# EAGLE design DINRELAY8 (EAGLE 8.7.0)
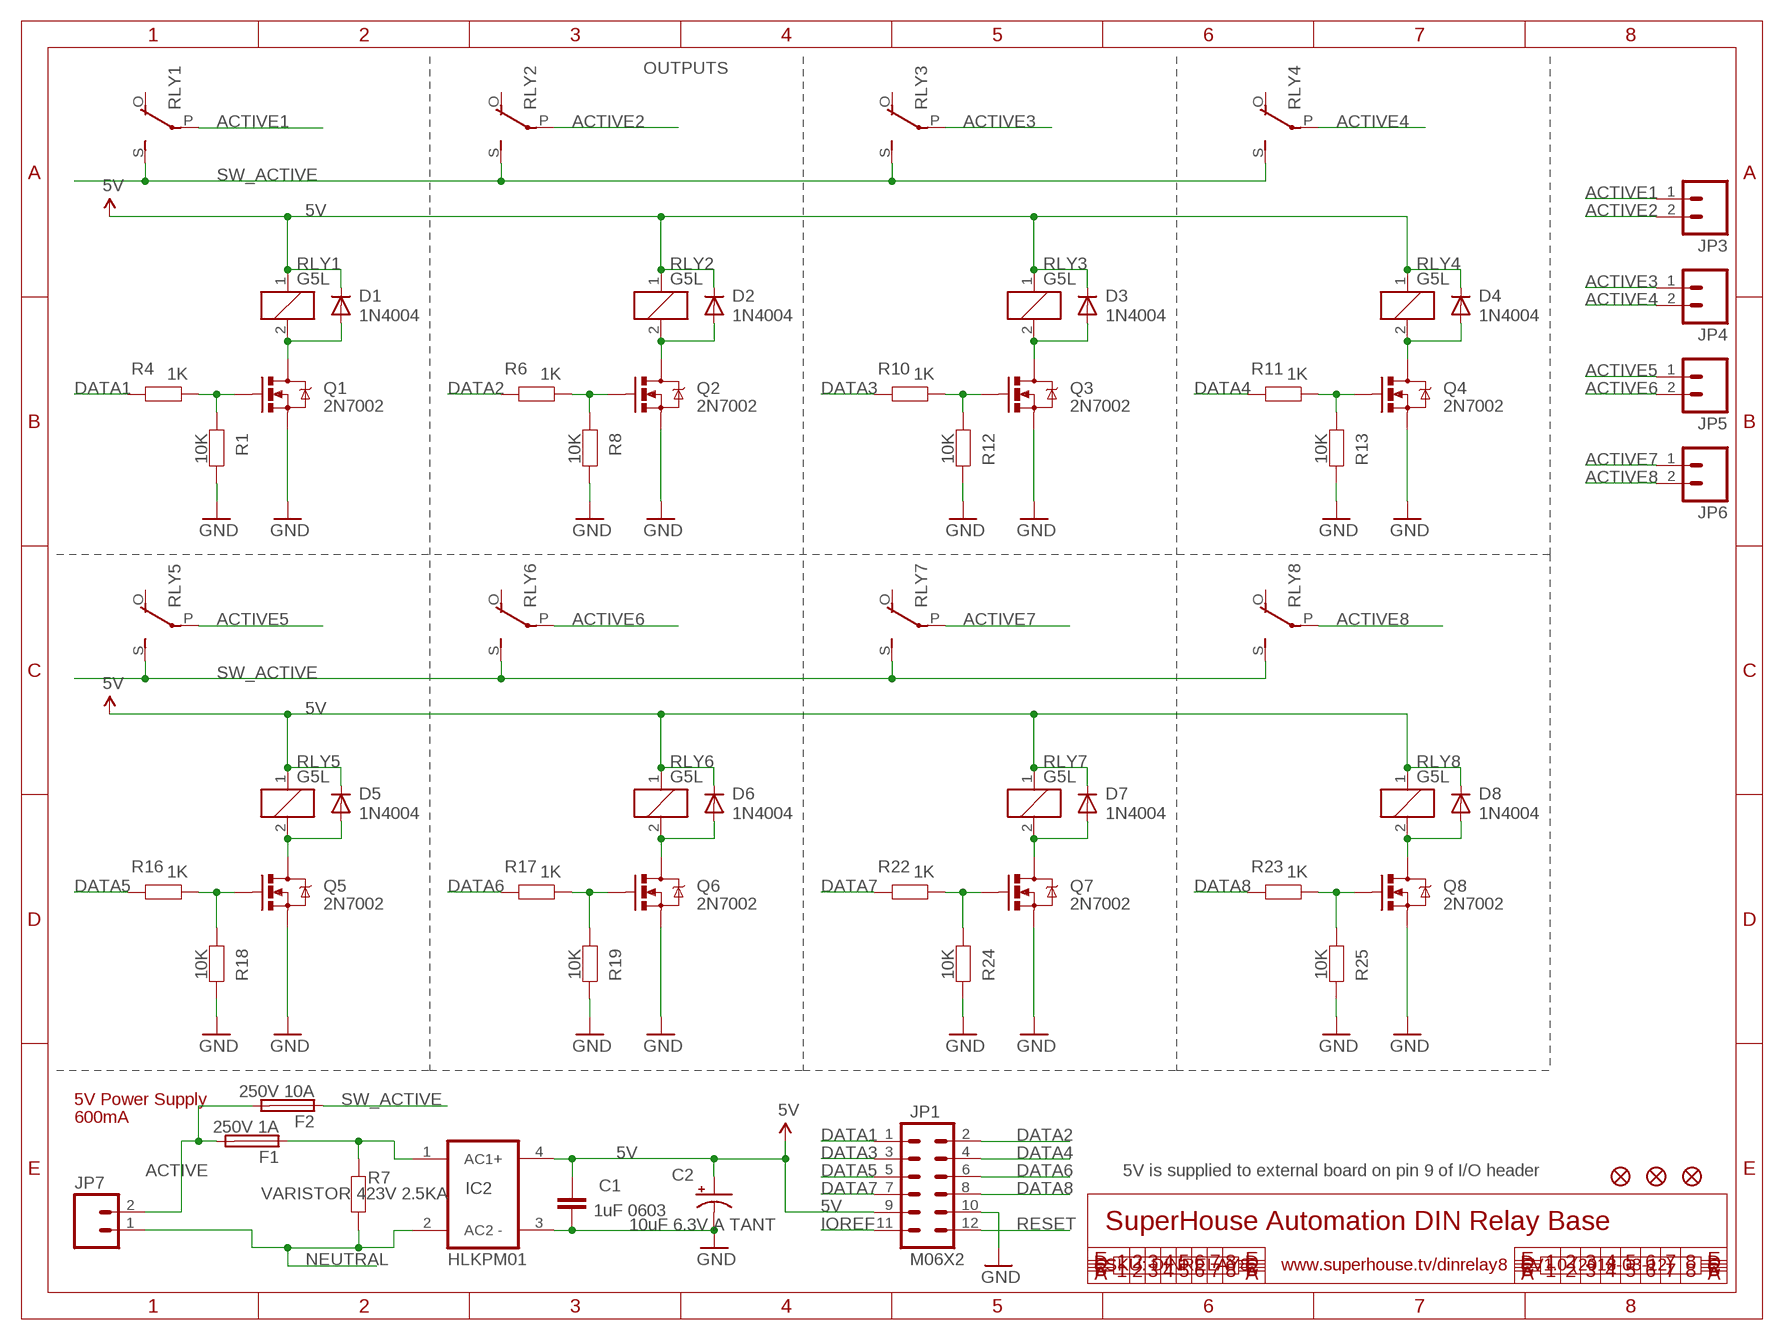
[diagram p0: schematic, sheet 1]

## Parts
C1  1uF 0603  CAP0603  [0603@1]
C2  10uF 6.3V A TANT  CAP_POL1206  [EIA3216]
D1  1N4004  DIODESMB  [SMB-DIODE]
D2  1N4004  DIODESMB  [SMB-DIODE]
D3  1N4004  DIODESMB  [SMB-DIODE]
D4  1N4004  DIODESMB  [SMB-DIODE]
D5  1N4004  DIODESMB  [SMB-DIODE]
D6  1N4004  DIODESMB  [SMB-DIODE]
D7  1N4004  DIODESMB  [SMB-DIODE]
D8  1N4004  DIODESMB  [SMB-DIODE]
F1  250V 1A  PICOFUSEH  [PICOFUSE]
F2  250V 10A  PICOFUSEH  [PICOFUSE]
FID1  FIDUCIAL1X2.5  [FIDUCIAL-1X2.5]
FID2  FIDUCIAL1X2.5  [FIDUCIAL-1X2.5]
FID3  FIDUCIAL1X2.5  [FIDUCIAL-1X2.5]
IC2  HLKPM01  [HLKPM01]
JP1  M06X2  [2X6-SHROUDED]
JP3  M025MM  [SCREWTERMINAL-5MM-2]
JP4  M025MM  [SCREWTERMINAL-5MM-2]
JP5  M025MM  [SCREWTERMINAL-5MM-2]
JP6  M025MM  [SCREWTERMINAL-5MM-2]
JP7  M025MM  [SCREWTERMINAL-5MM-2]
Q1  2N7002  MOSFET-NCHANNELSMD  [SOT23-3]
Q2  2N7002  MOSFET-NCHANNELSMD  [SOT23-3]
Q3  2N7002  MOSFET-NCHANNELSMD  [SOT23-3]
Q4  2N7002  MOSFET-NCHANNELSMD  [SOT23-3]
Q5  2N7002  MOSFET-NCHANNELSMD  [SOT23-3]
Q6  2N7002  MOSFET-NCHANNELSMD  [SOT23-3]
Q7  2N7002  MOSFET-NCHANNELSMD  [SOT23-3]
Q8  2N7002  MOSFET-NCHANNELSMD  [SOT23-3]
R1  10K  RESISTOR0603  [0603]
R4  1K  RESISTOR0603  [0603]
R6  1K  RESISTOR0603  [0603]
R7  VARISTOR 423V 2.5KA  RESISTORPTH1  [AXIAL-0.3]
R8  10K  RESISTOR0603  [0603]
R10  1K  RESISTOR0603  [0603]
R11  1K  RESISTOR0603  [0603]
R12  10K  RESISTOR0603  [0603]
R13  10K  RESISTOR0603  [0603]
R16  1K  RESISTOR0603  [0603]
R17  1K  RESISTOR0603  [0603]
R18  10K  RESISTOR0603  [0603]
R19  10K  RESISTOR0603  [0603]
R22  1K  RESISTOR0603  [0603]
R23  1K  RESISTOR0603  [0603]
R24  10K  RESISTOR0603  [0603]
R25  10K  RESISTOR0603  [0603]
RLY1  G5L  [G5LE]
RLY2  G5L  [G5LE]
RLY3  G5L  [G5LE]
RLY4  G5L  [G5LE]
RLY5  G5L  [G5LE]
RLY6  G5L  [G5LE]
RLY7  G5L  [G5LE]
RLY8  G5L  [G5LE]

## Nets
5V: C1.1 C2.A(+) D1.C D2.C D3.C D4.C D5.C D6.C D7.C D8.C IC2.4(+) JP1.9 RLY1.1 RLY2.1 RLY3.1 RLY4.1 RLY5.1 RLY6.1 RLY7.1 RLY8.1
$N16: F1.1 IC2.1(AC1) R7.P$2
ACTIVE: F1.2 F2.2 JP7.2
ACTIVE1: JP3.1 RLY1.P(2:P)
ACTIVE2: JP3.2 RLY2.P(2:P)
ACTIVE3: JP4.1 RLY3.P(2:P)
ACTIVE4: JP4.2 RLY4.P(2:P)
ACTIVE5: JP5.1 RLY5.P(2:P)
ACTIVE6: JP5.2 RLY6.P(2:P)
ACTIVE7: JP6.1 RLY7.P(2:P)
ACTIVE8: JP6.2 RLY8.P(2:P)
DATA1: JP1.1 R4.2
DATA2: JP1.2 R6.2
DATA3: JP1.3 R10.2
DATA4: JP1.4 R11.2
DATA5: JP1.5 R16.2
DATA6: JP1.6 R17.2
DATA7: JP1.7 R22.2
DATA8: JP1.8 R23.2
GND: C1.2 C2.C(-) IC2.3(-) JP1.10 Q1.2(S) Q2.2(S) Q3.2(S) Q4.2(S) Q5.2(S) Q6.2(S) Q7.2(S) Q8.2(S) R1.2 R8.2 R12.2 R13.2 R18.2 R19.2 R24.2 R25.2
IOREF: JP1.11
N$3: D2.A Q2.3(D) RLY2.2
N$4: D1.A Q1.3(D) RLY1.2
N$5: Q1.1(G) R1.1 R4.1
N$6: Q2.1(G) R6.1 R8.1
N$11: D4.A Q4.3(D) RLY4.2
N$12: D3.A Q3.3(D) RLY3.2
N$13: Q3.1(G) R10.1 R12.1
N$14: Q4.1(G) R11.1 R13.1
N$15: D6.A Q6.3(D) RLY6.2
N$16: D5.A Q5.3(D) RLY5.2
N$17: Q5.1(G) R16.1 R18.1
N$18: Q6.1(G) R17.1 R19.1
N$21: D8.A Q8.3(D) RLY8.2
N$22: D7.A Q7.3(D) RLY7.2
N$23: Q7.1(G) R22.1 R24.1
N$24: Q8.1(G) R23.1 R25.1
NEUTRAL: IC2.2(AC2) JP7.1 R7.P$1
RESET: JP1.12
SW_ACTIVE: F2.1 RLY1.S(2:S) RLY2.S(2:S) RLY3.S(2:S) RLY4.S(2:S) RLY5.S(2:S) RLY6.S(2:S) RLY7.S(2:S) RLY8.S(2:S)
Unconnected: RLY1.O(2:O) RLY2.O(2:O) RLY3.O(2:O) RLY4.O(2:O) RLY5.O(2:O) RLY6.O(2:O) RLY7.O(2:O) RLY8.O(2:O)

## Notes on the sheet
- OUTPUTS
- 5V Power Supply
- 600mA
- 5V is supplied to external board on pin 9 of I/O header
- SuperHouse Automation DIN Relay Base
- SKU: DINRELAY8 | www.superhouse.tv/dinrelay8 | V1.0 (2018-03-12)

## Library data of the parts
C1 = freetronics:CAP: Capacitor Standard 0603 ceramic capacitor, and 0.1" leaded capacitor.
C2 = freetronics:CAP_POL: Capacitor Polarized These are standard SMD and PTH capacitors. Normally 10uF, 47uF, and 100uF in electrolytic and tantalum varieties. Always verify the external diameter of the through hole cap, it varies with capacity, voltage, and manufacturer. The EIA devices should be standard.
D1-D8 = freetronics-master-v1.1:DIODE: Diode These are standard reverse protection diodes and small signal diodes. SMA package can handle up to about 1A. SOD-323 can handle about 200mA. What the SOD-323 package when ordering, there are some mfgs out there that are 5-pin packages.
F1 F2 = freetronics-jon:PICOFUSE: PICOFUSE 19275, Wickmann; OC_FARNELL: unknown; OC_NEWARK: unknown
FID1-FID3 = freetronics:FIDUCIAL: Fiducial Alignment Points Various fiducial points for machine vision alignment.
IC2 = freetronics-jon:HLKPM01
JP1 = freetronics-jon:M06X2
JP3-JP7 = freetronics-jon:M02: Header 2 Standard 2-pin 0.1" header. Use with straight break away headers (SKU : PRT-00116), right angle break away headers (PRT-00553), swiss pins (PRT-00743), machine pins (PRT-00117), and female headers (PRT-00115). Molex polarized connector foot print use with SKU : PRT-08233 with associated crimp pins and housings.
Q1-Q8 = freetronics-master-v1:MOSFET-NCHANNEL
R1 R4 R6 R8 R10-R13 R16-R19 R22-R25 = freetronics:RESISTOR: Resistor Basic schematic elements and footprints for 0603, 1206, and PTH 1/10th watt (small) resistors.
R7 = freetronics-master-v1.1:RESISTOR: Resistor Basic schematic elements and footprints for 0603, 1206, and PTH 1/10th watt (small) resistors.
RLY1-RLY8 = relay:G5L: RELAY 1 x switch, 10 A/120 V AC, 8 A/30 V ADC, Omron; OC_FARNELL: unknown; OC_NEWARK: unknown

## Net classes
0 Default: width 0.203 mm
1 VCC: width 0.305 mm

## Board
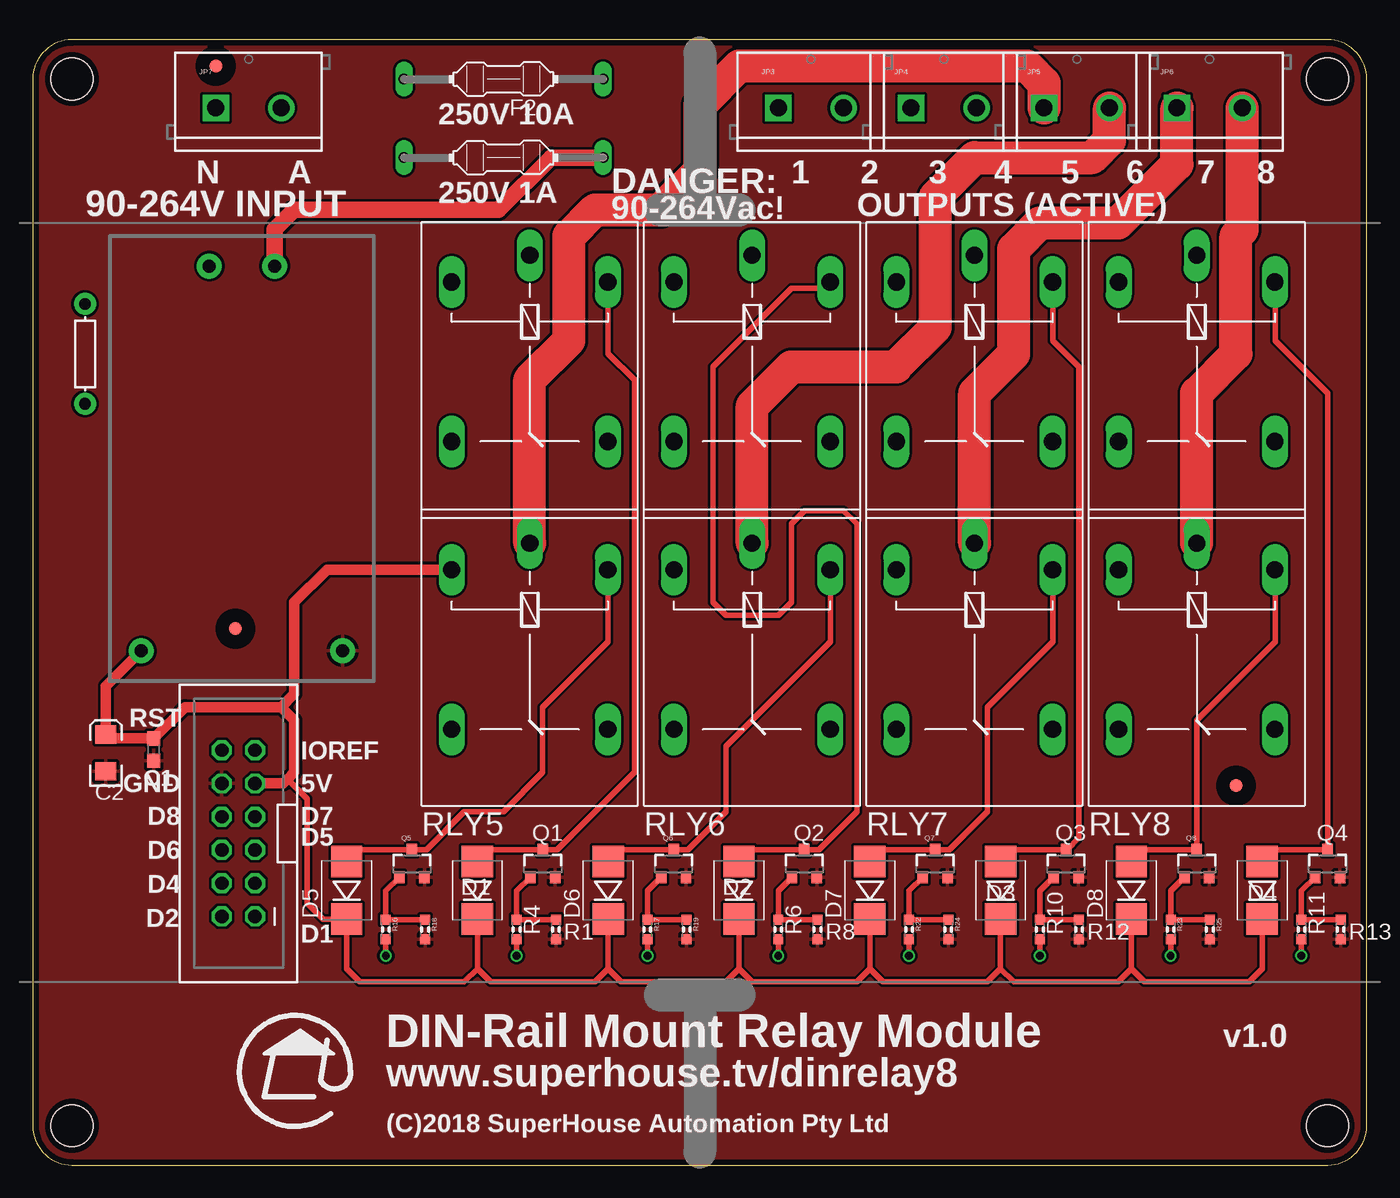
[diagram p1: board, top side]
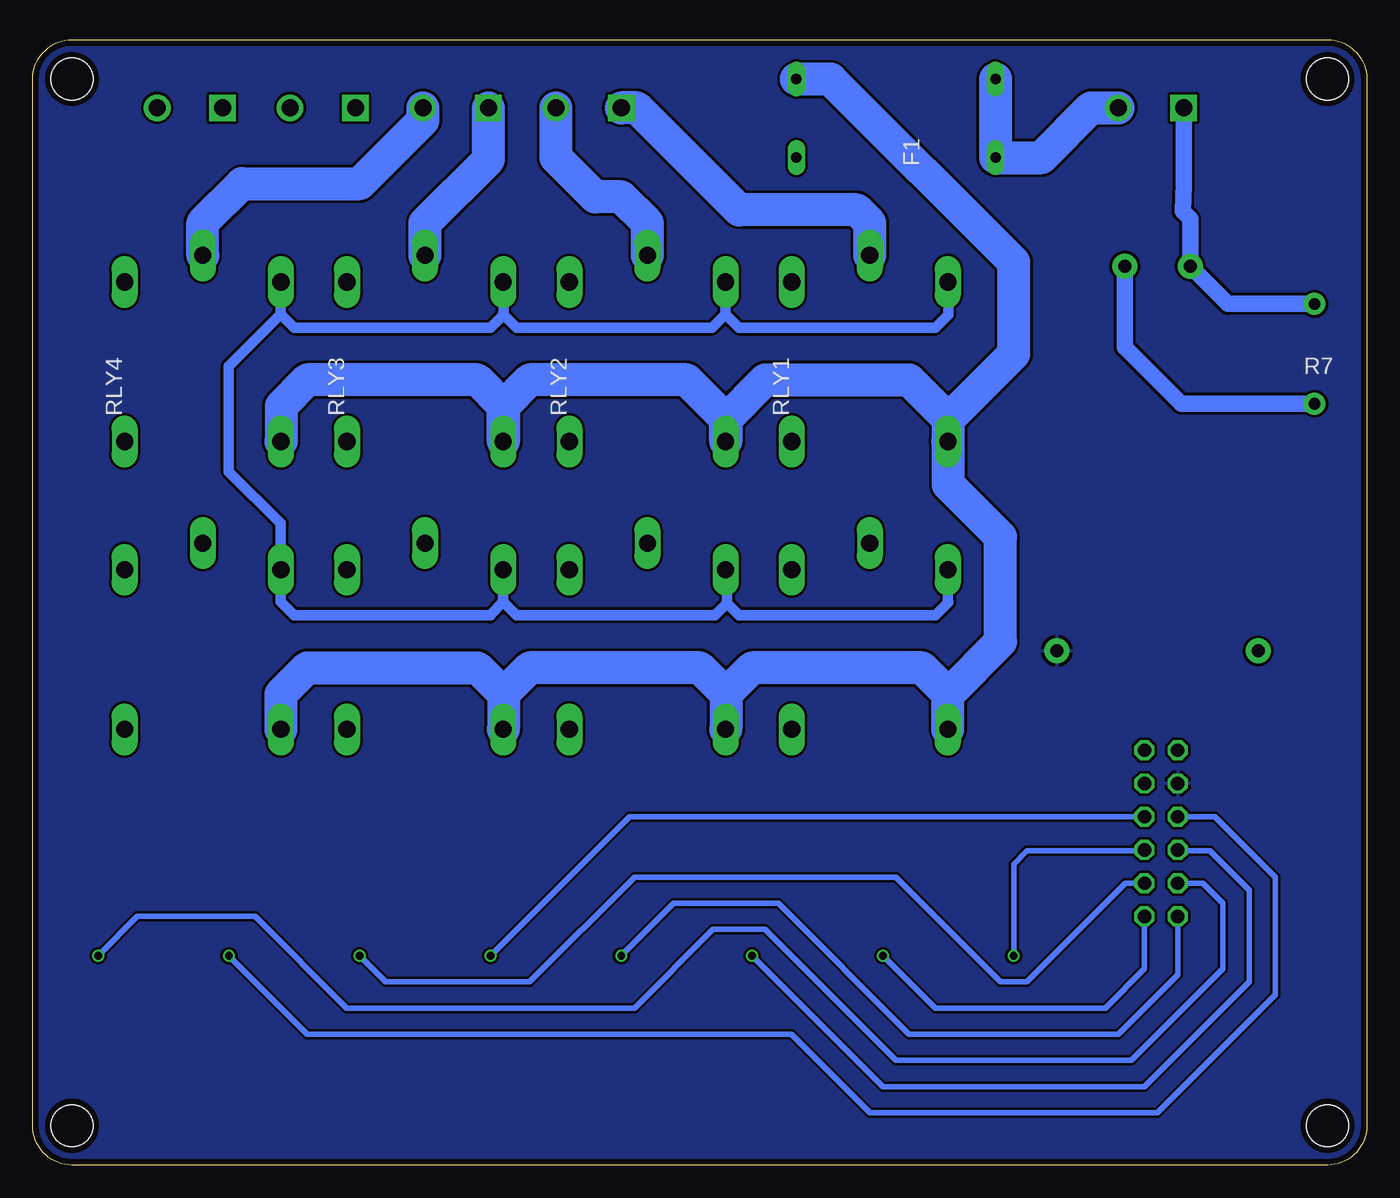
[diagram p2: board, bottom side, seen from below]

Size 102 x 86 mm. Coordinates in mm from the lower left corner, seen from the top.
Outline: 99,86 3,86 arc90 0,83 0,3 arc90 3,0 99,0 arc90 102,3 102,83 arc90 99,86
Copper layers (1*16): Top 0.035mm / dielectric 1.5mm / Bottom 0.035mm
Design rules "default": minimum track width 8mil, minimum drill 15mil, track to track 8mil, track to pad 8mil, pad to pad 8mil, via to via 8mil, smd to smd 8mil, copper to edge 18mil, drill to drill 8mil, minimum pad ring 10mil, minimum via ring 6mil, stop-mask expansion 4mil, vias tented up to drill 25mil, thermal gap 10mil
Holes 3.2 mm at 3,3 3,83 99,3 99,83
tRestrict: area 13,83 to 15,85; area 14.5,40 to 16.5,42; area 91,28 to 93,30

### Footprints (pad centres in the part's own frame; a part is rotated, then mirrored left to right if it is on the bottom)
0603@1 = smd 1.1 x 1: 1 -0.85,0; 2 0.85,0
EIA3216 = smd 1.4 x 1.6: A 1.4,0; C -1.4,0
SMB-DIODE = smd 2.4 x 2.4: A 2.2,0; C -2.2,0
PICOFUSE = drill 0.813 long: 1 -7.62,0; 2 7.62,0
FIDUCIAL-1X2.5 = smd 1 x 1: 1 0,0
HLKPM01 = drill 1 pad 1.93: 1 -14.7,2.5; 2 -14.7,-2.5; 3 14.7,7.7; 4 14.7,-7.7
2X6-SHROUDED = drill 1.016 octagon: 1 0,0; 2 2.54,0; 3 0,-2.54; 4 2.54,-2.54; 5 0,-5.08; 6 2.54,-5.08; 7 0,-7.62; 8 2.54,-7.62; 9 0,-10.16; 10 2.54,-10.16; 11 0,-12.7; 12 2.54,-12.7
SCREWTERMINAL-5MM-2 = drill 1.3 pad 2.032 square: 1 0,0 | drill 1.3 pad 2.032: 2 5,0
SOT23-3 = smd 0.8 x 0.9: 1 -0.95,-1; 2 0.95,-1; 3 0,1.1
0603 = smd 0.762 x 0.762: 1 -0.762,0; 2 0.762,0
AXIAL-0.3 = drill 0.9 pad 1.676: P$1 -3.81,0; P$2 3.81,0
G5LE = drill 1.321 long: 1 -7.493,-5.969; 2 -7.493,5.969; O 4.699,5.969; P -9.525,0; S 4.699,-5.969

### Placement (x,y rotation side)
C1  9.24,31.75 270 top
C2  5.59,31.5 90 top
D1  34,21 90 top
D2  54,21 90 top
D3  74,21 90 top
D4  94,21 90 top
D5  24,21 90 top
D6  44,21 90 top
D7  64,21 90 top
D8  84,21 90 top
F1  36,77 180 top
F2  36,83 180 top
FID1  14,84 180 top
FID2  15.5,41 180 top
FID3  92,29 180 top
IC2  16,54 270 top
JP1  17,19 180 top
JP3  57,80.8 0 top
JP4  67.16,80.8 0 top
JP5  77.32,80.8 0 top
JP6  87.48,80.8 0 top
JP7  14,80.8 0 top
Q1  39,23 0 top
Q2  59,23 0 top
Q3  79,23 0 top
Q4  99,23 0 top
Q5  29,23 0 top
Q6  49,23 0 top
Q7  69,23 0 top
Q8  89,23 0 top
R1  40,18 270 top
R4  37,18 270 top
R6  57,18 270 top
R7  4,62 270 top
R8  60,18 270 top
R10  77,18 270 top
R11  97,18 270 top
R12  80,18 270 top
R13  100,18 270 top
R16  27,18 270 top
R17  47,18 270 top
R18  30,18 270 top
R19  50,18 270 top
R22  67,18 270 top
R23  87,18 270 top
R24  70,18 270 top
R25  90,18 270 top
RLY1  38,60 270 top
RLY2  55,60 270 top
RLY3  72,60 270 top
RLY4  89,60 270 top
RLY5  38,38 270 top
RLY6  55,38 270 top
RLY7  72,38 270 top
RLY8  89,38 270 top

### Tracks (layer width: path | path; a pad name or v marks a point on that pad's centre or on a via)
5V
  Top 0.406: D4.C 94,15 93,14 85,14 84,15 | 84,15 D8.C | 74,15 D3.C | 74,15 75,14 83,14 84,15 | 64,15 D7.C | 64,15 65,14 73,14 74,15 | 54,15 D2.C | 54,15 55,14 63,14 64,15 | 44,15 D6.C | 44,15 45,14 53,14 54,15 | 34,15 D1.C | 34,15 35,14 43,14 44,15 | 34,15 33,14 25,14 24,15 D5.C 22.2,18.8 21,20 21,28 19.5,29.5
  Top 0.813: IC2.4 5.59,36.59 C2.A 5.89,32.6 C1.1 11.64,35 19,35 | 19,35 20,34 20,30 19.5,29.5 19.16,29.16 JP1.9 | RLY5.1 22.49,45.49 20,43 20,36 19,35
  Bottom 0.406: 32,67.46 RLY1.1 | 66,67.46 RLY3.1 66.03,65.03
  Bottom 0.813: 49.03,65.03 RLY2.1 | 49.03,65.03 48,64 33,64 32,65 32,67.46 | 83.03,65.03 RLY4.1 | 83.03,65.03 82,64 67,64 66,65 66,67.46 | 66.03,65.03 65,64 50.06,64 49.03,65.03 | RLY5.1 32.03,43.03 32,43 33,42 48,42 48.92,42.92 | RLY6.1 48.92,45.38 48.92,42.92 | 48.92,42.92 49.83,42 65,42 66.03,43.03 | 66.03,43.03 RLY7.1 | 66.03,43.03 67,42.06 67,42 82,42 83.03,43.03 RLY8.1 83.03,49.03 87,53 87,61.06 83.03,65.03
$N16
  Top 1.27: IC2.1 18.5,71.5 20,73 35.62,73 39.62,77 F1.1
  Bottom 1.27: R7.P$2 14.19,58.19 18.5,62.5 IC2.1
ACTIVE
  Bottom 2.54: F2.2 F1.2 24.88,77 21.08,80.8 JP7.2
ACTIVE1
  Bottom 2.54: RLY1.P 38,72 39,73 48,73 55.8,80.8 JP3.1
ACTIVE2
  Bottom 2.54: RLY2.P 55,72 57,74 59,74 62,77 JP3.2
ACTIVE3
  Bottom 2.54: RLY3.P 72,72 67.16,76.84 JP4.1
ACTIVE4
  Bottom 2.54: RLY4.P 89,72 86,75 77,75 72.16,79.84 JP4.2
ACTIVE5
  Top 2.54: RLY5.P 38,60 41,63 41,71 43,73 48,73 51,76 51,81 54,84 76,84 77.32,82.68 JP5.1
ACTIVE6
  Top 2.54: RLY6.P 55,58 58,61 66,61 69,64 69,74 72,77 81,77 82.32,78.32 JP5.2
ACTIVE7
  Top 2.54: RLY7.P 72,59 75,62 75,70 77,72 83,72 87.48,76.48 JP6.1
ACTIVE8
  Top 2.54: RLY8.P 89,59 92,62 92,71 92.48,71.48 JP6.2
DATA1  (via drill 0.6)
  Top 0.406: R4.2 v37,16
  Bottom 0.406: v37,16 33,12 20,12 17,15 JP1.1
DATA2  (via drill 0.6)
  Top 0.406: R6.2 v57,16
  Bottom 0.406: v57,16 53,20 45,20 35,10 19,10 14.46,14.54 JP1.2
DATA3  (via drill 0.6)
  Top 0.406: R10.2 v77,16
  Bottom 0.406: v77,16 75,14 64,14 56,22 36,22 28,14 26,14 18.46,21.54 JP1.3
DATA4  (via drill 0.6)
  Top 0.406: R11.2 v97,16
  Bottom 0.406: JP1.4 12.54,21.54 11,20 11,15 18,8 36,8 46,18 50,18 56,12 78,12 85,19 94,19 v97,16
DATA5  (via drill 0.6)
  Top 0.406: R16.2 v27,16
  Bottom 0.406: v27,16 27,23 26,24 17.08,24 JP1.5
DATA6  (via drill 0.6)
  Top 0.406: R17.2 v47,16
  Bottom 0.406: v47,16 37,6 17,6 9,14 9,21 12,24 14.38,24 JP1.6
DATA7  (via drill 0.6)
  Top 0.406: R22.2 v67,16
  Bottom 0.406: JP1.7 56.38,26.62 v67,16
DATA8  (via drill 0.6)
  Top 0.406: R23.2 v87,16
  Bottom 0.406: v87,16 81,10 44,10 38,4 16,4 7,13 7,22 11.62,26.62 JP1.8
GND
  pour Bottom: 99,0 3,0 arc-90 0,3 0,83 arc-90 3,86 99,86 arc-90 102,83 102,3 arc-90
  pour Top: 99,0 3,0 arc-90 0,3 0,83 arc-90 3,86 99,86 arc-90 102,83 102,3 arc-90
N$3
  Top 0.305: 54.9,24.1 D2.A
  Top 0.406: 54.9,24.1 Q2.3 60.1,24.1 63,27 63,49 62,50 59,50 58,49 58,43 57,42 53,42 52,43 52,61 58,67 60.48,67 RLY2.2
N$4
  Top 0.305: 34.9,24.1 D1.A
  Top 0.406: 34.9,24.1 Q1.3 40.1,24.1 46,30 46,60 44,62 44,67.46 RLY1.2
N$5
  Top 0.406: R1.1 R4.1 37,20.95 Q1.1
N$6
  Top 0.406: R8.1 R6.1 57,20.95 Q2.1
N$11
  Top 0.305: 94.9,24.1 D4.A
  Top 0.406: 94.9,24.1 Q4.3 99,59 95,63 95,67.46 RLY4.2
N$12
  Top 0.305: 74.9,24.1 D3.A
  Top 0.406: 74.9,24.1 Q3.3 79.1,24.1 80,25 80,61 78,63 78,67.46 RLY3.2
N$13
  Top 0.406: Q3.1 77,20.95 R10.1 R12.1
N$14
  Top 0.406: R13.1 R11.1 97,20.95 Q4.1
N$15
  Top 0.305: 44.9,24.1 D6.A
  Top 0.406: 44.9,24.1 Q6.3 50.1,24.1 53,27 53,32 61,40 61,45.46 RLY6.2
N$16
  Top 0.305: 24.9,24.1 D5.A
  Top 0.406: 24.9,24.1 Q5.3 30.1,24.1 33,27 36,27 39,30 39,35 44,40 44,45.46 RLY5.2
N$17
  Top 0.406: R18.1 R16.1 27,20.95 Q5.1
N$18
  Top 0.406: R19.1 R17.1 47,20.95 Q6.1
N$21
  Top 0.305: 84.9,24.1 D8.A
  Top 0.406: 84.9,24.1 Q8.3 89,34 95,40 95,45.46 RLY8.2
N$22
  Top 0.305: 64.9,24.1 D7.A
  Top 0.406: 64.9,24.1 Q7.3 70.1,24.1 73,27 73,35 78,40 78,45.46 RLY7.2
N$23
  Top 0.406: R24.1 R22.1 67,20.95 Q7.1
N$24
  Top 0.406: R25.1 R23.1 87,20.95 Q8.1
NEUTRAL
  Bottom 1.27: R7.P$1 10.61,65.81 IC2.2 13.5,72.31 14.08,72.89 14,74.97 JP7.1
SW_ACTIVE
  Bottom 2.54: RLY4.S 83,55.33 83,58 81,60 68,60 66.03,58.03 RLY3.S 66,55.33 66,58 64,60 52,60 49.03,57.03 RLY2.S 49,55.33 49,57 46,60 35,60 32,57 | 32,55.33 32,57 | 32,55.33 RLY1.S | RLY8.S 83.03,35.97 81,38 68,38 66,36 | 66,36 66,33.33 RLY7.S | RLY5.S 32.03,36.03 | 32.03,36.03 34,38 47,38 49,36 | 49,36 49,33.33 RLY6.S | 49,36 51,38 64,38 66,36 | 32.03,36.03 31.97,36.03 28,40 28,48 32,52 32,55.33 | 32,57 27,62 27,69 41,83 F2.1

### Text on the board
tPlace: 250V 10A | N | A | 1 | 2 | 3 | 4 | 5 | 6 | 7 | 8 | 250V 1A | DANGER: | 90-264V INPUT | 90-264Vac! | OUTPUTS (ACTIVE) | RST | IOREF | GND | 5V | D8 | D7 | D5 | D6 | D4 | D2 | D1 | DIN-Rail Mount Relay Module | v1.0 | www.superhouse.tv/dinrelay8 | (C)2018 SuperHouse Automation Pty Ltd